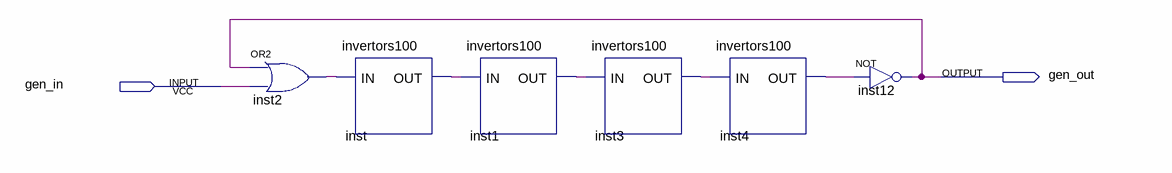
[diagram p0: schematic sheet]
// Quartus schematic generator.bdf as structural Verilog: 6 symbols, 2 pins
module generator (
  input  gen_in,
  output gen_out
);

  wire inst1_out, inst2_out, inst3_out, inst4_out, inst_out;

  or inst2 (inst2_out, gen_out, gen_in);
  invertors100 inst (.IN(inst2_out), .OUT(inst_out));
  invertors100 inst1 (.IN(inst_out), .OUT(inst1_out));
  invertors100 inst3 (.IN(inst1_out), .OUT(inst3_out));
  invertors100 inst4 (.IN(inst3_out), .OUT(inst4_out));
  not inst12 (gen_out, inst4_out);
endmodule
